# Altium schematic sheet RelayDetect.SchDoc
size A4; ENG_APP_DATE: --/--/--; DSN_APP_DATE: --/--/--; CHK_APP_DATE: --/--/--; Date: 04.01.2021; Organization: Altium Limited; Address1: L3, 12a Rodborough Rd; Address2: Frenchs Forest; Address3: NSW; Address4: Australia 2086; SheetNumber: 2; SheetTotal: 2; Название устройства: Reciever; Version: 1
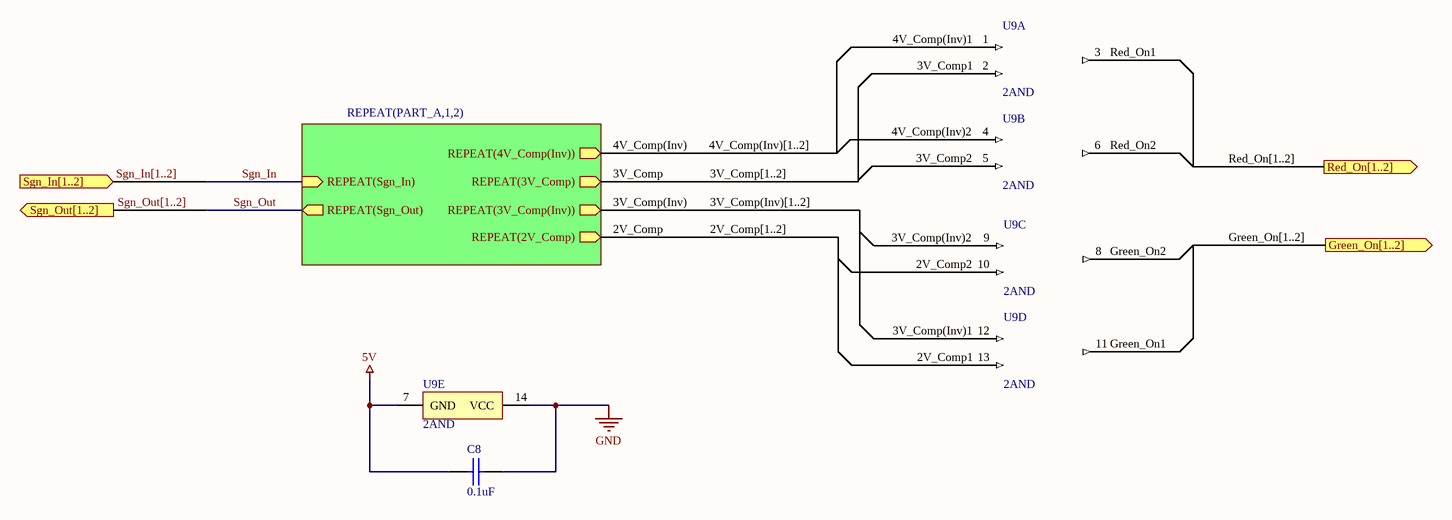
[diagram p0: RelayDetect.SchDoc]

## Parts
C8  0.1uF  [0805 Capicator]
U9  2AND  [SOIC-14]  (parts A,B,C,D,E of 5)

## Sub-sheets
REPEAT(PART_A,1,2) = RelayDetect2.SchDoc: REPEAT(Sgn_In) (in), REPEAT(Sgn_Out) (out), REPEAT(4V_Comp(Inv)) (out), REPEAT(3V_Comp) (out), REPEAT(3V_Comp(Inv)) (out), REPEAT(2V_Comp) (out)

## Ports
Green_On[1..2] (out), Red_On[1..2] (out), Sgn_In[1..2] (in), Sgn_Out[1..2] (out)

## Nets
5V: C8.1 U9.7(GND)
GND: C8.2 U9.14(VCC)
2V_Comp: sheet REPEAT(PART_A,1,2)/REPEAT(2V_Comp)
2V_Comp1: U9.13(B)
2V_Comp2: U9.10(B)
3V_Comp: sheet REPEAT(PART_A,1,2)/REPEAT(3V_Comp)
3V_Comp1: U9.2(B)
3V_Comp2: U9.5(B)
3V_Comp(Inv): sheet REPEAT(PART_A,1,2)/REPEAT(3V_Comp(Inv))
3V_Comp(Inv)1: U9.12(A)
3V_Comp(Inv)2: U9.9(A)
4V_Comp(Inv): sheet REPEAT(PART_A,1,2)/REPEAT(4V_Comp(Inv))
4V_Comp(Inv)1: U9.1(A)
4V_Comp(Inv)2: U9.4(A)
Green_On1: U9.11(Y)
Green_On2: U9.8(Y)
Red_On1: U9.3(Y)
Red_On2: U9.6(Y)
Sgn_In: sheet REPEAT(PART_A,1,2)/REPEAT(Sgn_In)
Sgn_Out: sheet REPEAT(PART_A,1,2)/REPEAT(Sgn_Out)

## Buses and harness runs
bus 2V_Comp[1..2]
bus 3V_Comp(Inv)[1..2]
bus 3V_Comp[1..2]
bus 4V_Comp(Inv)[1..2]
bus Green_On[1..2] = port Green_On[1..2]
bus Red_On[1..2] = port Red_On[1..2]
bus Sgn_In[1..2] = port Sgn_In[1..2]
bus Sgn_Out[1..2] = port Sgn_Out[1..2]

## Notes on the sheet
- Size:
- Date:
- A4
- Car#:
- Time:
- 418
- Team:
- Sheet
- BRT
- of
- University:
- Technical University
- Bauman Moscow State
- Document Version:

## Library data of the parts
C8 = Cap 0.1uF (0805): 0.1uF X7R 50V 10% 0805; Manufacturer: Murata Manufacturing; Part Number: GRM21BR71E104KA01L; Type: Capacitor; ComponentLink1Description: Chip&Dip; ComponentLink1URL: https://www.chipdip.ru/product/grm21br71e104ka01l
U9 = 4 (2AND): Chip&Dip: https://www.chipdip.ru/product/sn74ac08dr